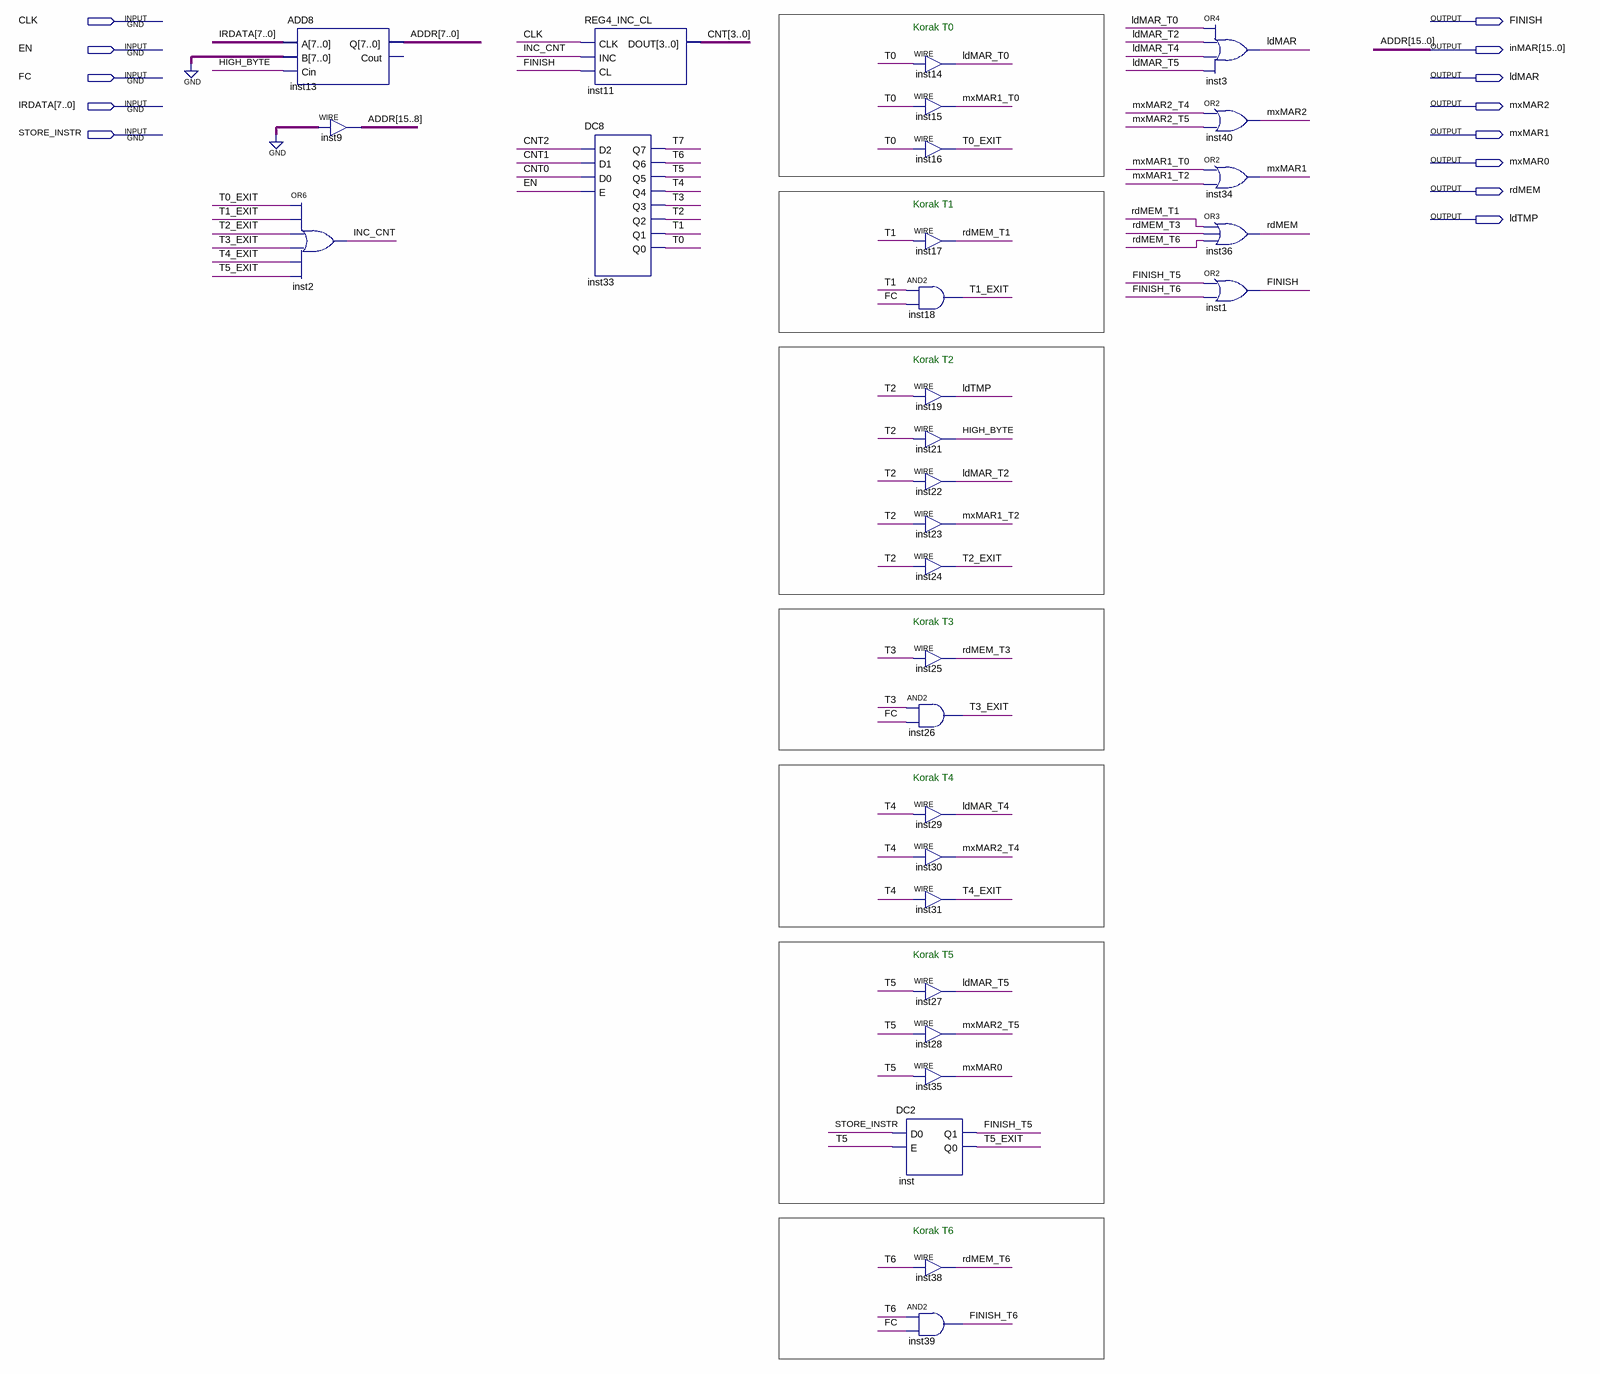
[diagram p0: schematic sheet]
// Quartus schematic ind_idy.bdf as structural Verilog: 31 symbols, 13 pins
module ind_idy (
  input  CLK,
  input  EN,
  input  FC,
  input  [7:0] IRDATA,
  input  STORE_INSTR,
  output FINISH,
  output [15:0] inMAR,
  output ldMAR,
  output mxMAR2,
  output mxMAR1,
  output mxMAR0,
  output rdMEM,
  output ldTMP
);

  wire FINISH_T5, FINISH_T6, HIGH_BYTE, INC_CNT, ldMAR_T0, ldMAR_T2, ldMAR_T4, ldMAR_T5, mxMAR1_T0,
       mxMAR1_T2, mxMAR2_T4, mxMAR2_T5, rdMEM_T1, rdMEM_T3, rdMEM_T6, T0, T0_EXIT, T1, T1_EXIT, T2, T2_EXIT,
       T3, T3_EXIT, T4, T4_EXIT, T5, T5_EXIT, T6, T7;
  wire [3:0] CNT;

  ADD8 inst13 (.A(IRDATA), .B({8{1'b0}}), .Cin(HIGH_BYTE), .Q(inMAR[7:0]));  // open: Cout
  or inst2 (INC_CNT, T0_EXIT, T1_EXIT, T2_EXIT, T3_EXIT, T4_EXIT, T5_EXIT);
  assign inMAR[15:8] = {8{1'b0}};  // WIRE inst9
  REG4_INC_CL inst11 (.CLK(CLK), .INC(INC_CNT), .CL(FINISH), .DOUT(CNT));
  DC8 inst33 (
    .D2(CNT[2]), .D1(CNT[1]), .D0(CNT[0]), .E(EN), .Q7(T7), .Q6(T6), .Q5(T5), .Q4(T4), .Q3(T3), .Q2(T2),
    .Q1(T1), .Q0(T0));
  assign ldMAR_T0 = T0;  // WIRE inst14
  assign mxMAR1_T0 = T0;  // WIRE inst15
  assign T0_EXIT = T0;  // WIRE inst16
  assign rdMEM_T1 = T1;  // WIRE inst17
  and inst18 (T1_EXIT, T1, FC);
  assign ldTMP = T2;  // WIRE inst19
  assign HIGH_BYTE = T2;  // WIRE inst21
  assign ldMAR_T2 = T2;  // WIRE inst22
  assign mxMAR1_T2 = T2;  // WIRE inst23
  assign T2_EXIT = T2;  // WIRE inst24
  assign rdMEM_T3 = T3;  // WIRE inst25
  and inst26 (T3_EXIT, T3, FC);
  assign ldMAR_T4 = T4;  // WIRE inst29
  assign mxMAR2_T4 = T4;  // WIRE inst30
  assign T4_EXIT = T4;  // WIRE inst31
  assign ldMAR_T5 = T5;  // WIRE inst27
  assign mxMAR2_T5 = T5;  // WIRE inst28
  assign mxMAR0 = T5;  // WIRE inst35
  DC2 inst (.D0(STORE_INSTR), .E(T5), .Q1(FINISH_T5), .Q0(T5_EXIT));
  assign rdMEM_T6 = T6;  // WIRE inst38
  and inst39 (FINISH_T6, T6, FC);
  or inst3 (ldMAR, ldMAR_T0, ldMAR_T2, ldMAR_T4, ldMAR_T5);
  or inst40 (mxMAR2, mxMAR2_T4, mxMAR2_T5);
  or inst34 (mxMAR1, mxMAR1_T0, mxMAR1_T2);
  or inst36 (rdMEM, rdMEM_T1, rdMEM_T3, rdMEM_T6);
  or inst1 (FINISH, FINISH_T5, FINISH_T6);

  // Other names for the same wires on the sheet: ADDR[15:0] = inMAR

  // Notes on the sheet:
  //   Korak T0
  //   Korak T1
  //   Korak T2
  //   Korak T3
  //   Korak T4
  //   Korak T5
  //   Korak T6
endmodule
